# EAGLE schematic EEG (EAGLE 9.6.2)
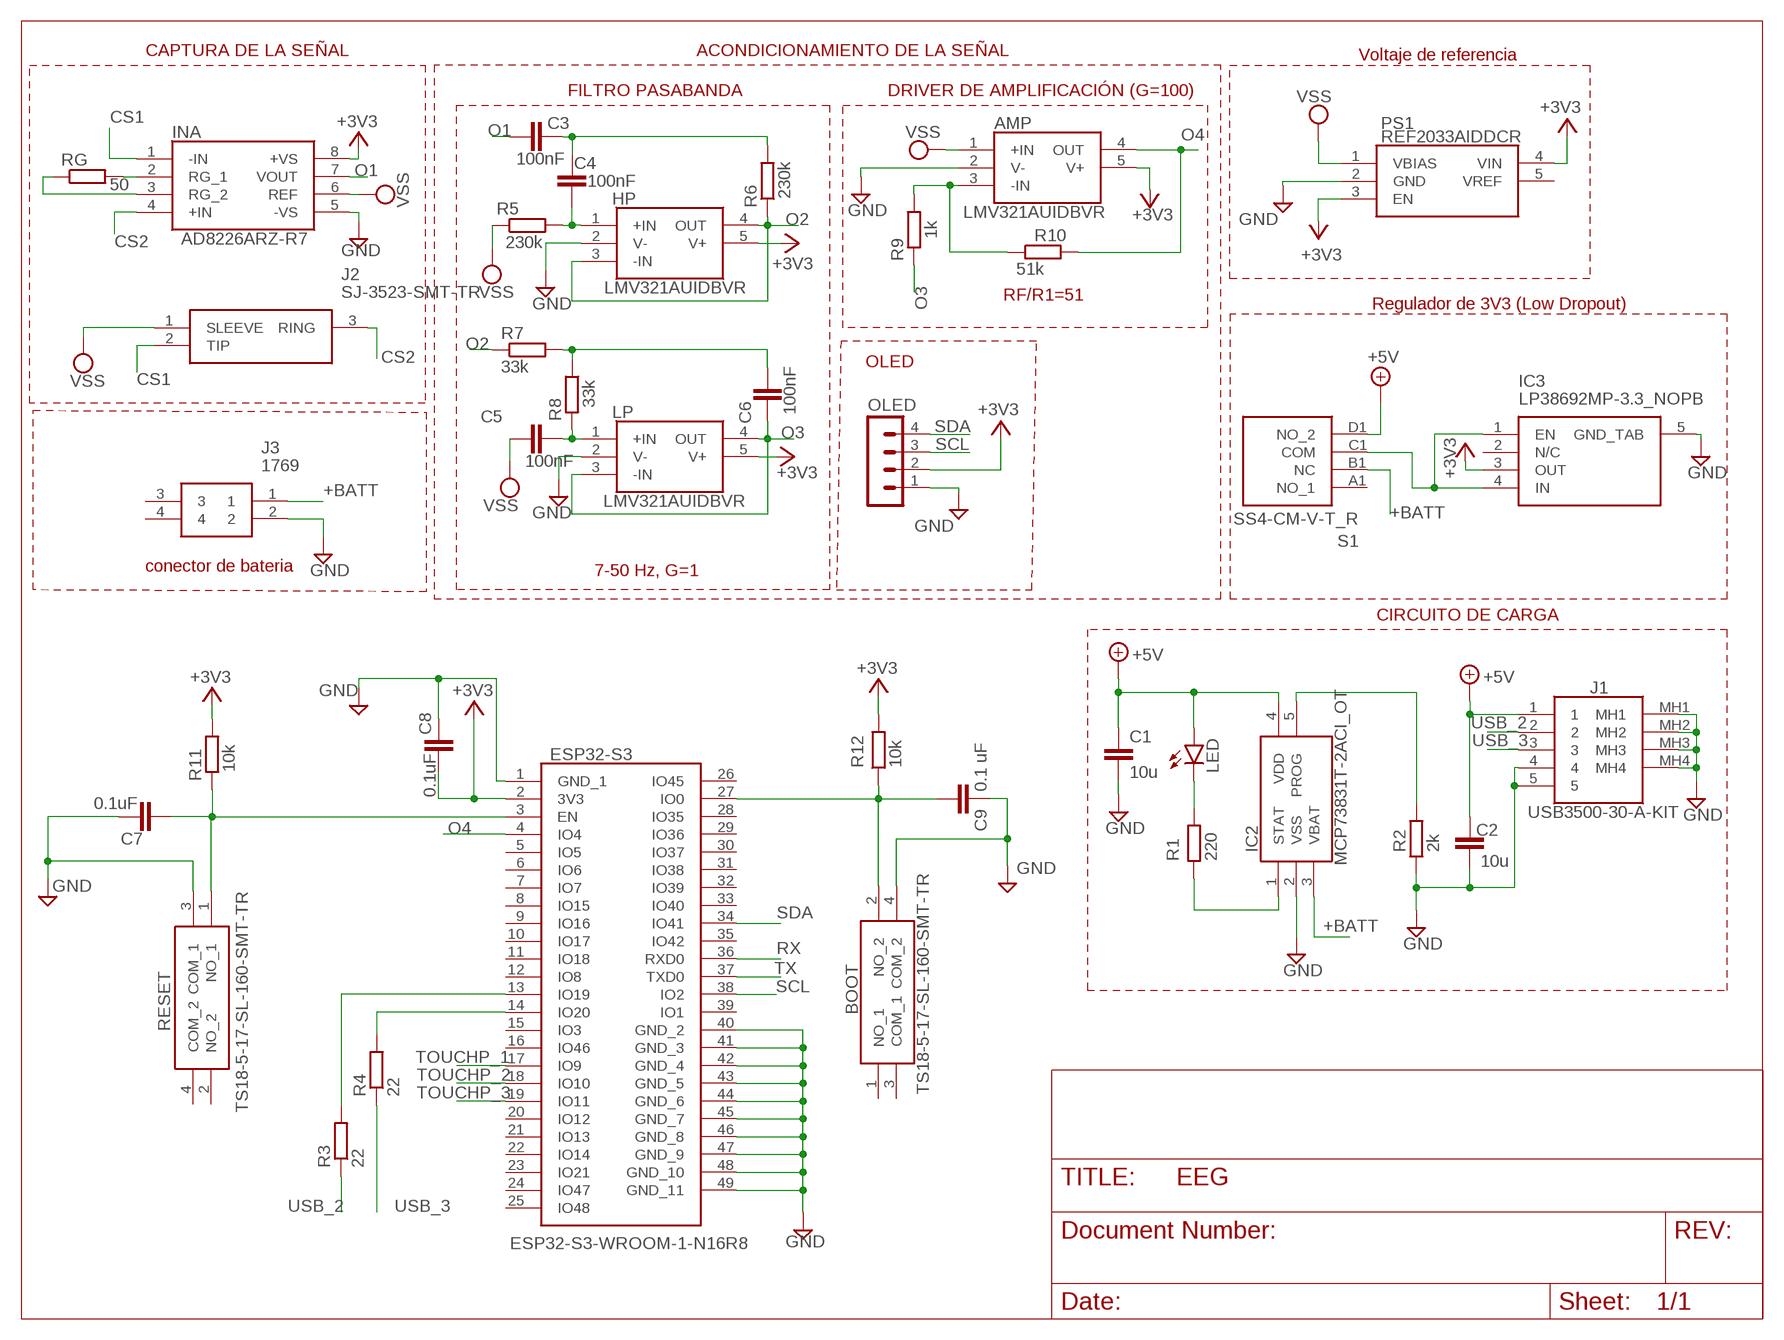
[diagram p0: schematic, sheet 1]

## Parts
AMP  LMV321AUIDBVR  [SOT95P280X145-5N]
BOOT  TS18-5-17-SL-160-SMT-TR  [TS18517SL160SMTTR]
C1  10u  C-EUC0805K  [C0805K]
C2  10u  C-EUC0805K  [C0805K]
C3  100nF  C-EUC0805  [C0805]
C4  100nF  C-EUC0805  [C0805]
C5  100nF  C-EUC0805  [C0805]
C6  100nF  C-EUC0805  [C0805]
C7  0.1uF  C-EUC0805  [C0805]
C8  0.1uF  C-EUC0805  [C0805]
C9  0.1 uF  C-EUC0805  [C0805]
ESP32-S3  ESP32-S3-WROOM-1-N16R8  [ESP32S3WROOM1N16R8]
HP  LMV321AUIDBVR  [SOT95P280X145-5N]
IC2  MCP73831T-2ACI_OT  [SOT95P270X145-5N]
IC3  LP38692MP-3.3_NOPB  [SOT150P700X180-5N]
INA  AD8226ARZ-R7  [SOIC127P600X175-8N]
J1  USB3500-30-A-KIT  [USB350030AKIT]
J2  SJ-3523-SMT-TR  [SJ3523SMTTR]
J3  1769  [1769]
LED  LEDCHIPLED_0805  [CHIPLED_0805]
LP  LMV321AUIDBVR  [SOT95P280X145-5N]
OLED  MA04-1  [MA04-1]
PS1  REF2033AIDDCR  [SOT95P280X110-5N]
R1  220  R-EU_R0805  [R0805]
R2  2k  R-EU_R0805  [R0805]
R3  22  R-EU_R0805  [R0805]
R4  22  R-EU_R0805  [R0805]
R5  230k  R-EU_R0805  [R0805]
R6  230k  R-EU_R0805  [R0805]
R7  33k  R-EU_R0805  [R0805]
R8  33k  R-EU_R0805  [R0805]
R9  1k  R-EU_R0805  [R0805]
R10  51k  R-EU_R0805  [R0805]
R11  10k  R-EU_R0805  [R0805]
R12  10k  R-EU_R0805  [R0805]
RESET  TS18-5-17-SL-160-SMT-TR  [TS18517SL160SMTTR]
RG  50  R-EU_M0805  [M0805]
S1  SS4-CM-V-T_R  [SS4CMVTR]

## Nets
+3V3: AMP.5(V+) C8.1 ESP32-S3.2(3V3) HP.5(V+) IC3.3(OUT) INA.8(+VS) LP.5(V+) OLED.2 PS1.3(EN) PS1.4(VIN) R11.2 R12.2
+5V: C1.1 C2.1 IC2.4(VDD) J1.1 LED.A S1.D1(NO_2)
+BATT: IC2.3(VBAT) J3.1 S1.B1(NC)
CS1: INA.1(-IN) J2.2(TIP)
CS2: INA.4(+IN) J2.3(RING)
GND: AMP.2(V-) BOOT.4(COM_2) C1.2 C2.2 C7.1 C8.2 C9.1 ESP32-S3.1(GND_1) ESP32-S3.40(GND_2) ESP32-S3.41(GND_3) ESP32-S3.42(GND_4) ESP32-S3.43(GND_5) ESP32-S3.44(GND_6) ESP32-S3.45(GND_7) ESP32-S3.46(GND_8) ESP32-S3.47(GND_9) ESP32-S3.48(GND_10) ESP32-S3.49(GND_11) HP.2(V-) IC2.2(VSS) IC3.5(GND_TAB) INA.5(-VS) J1.4 J1.5 J1.MH1 J1.MH2 J1.MH3 J1.MH4 J3.2 LP.2(V-) OLED.1 PS1.2(GND) R2.1 RESET.3(COM_1)
N$2: IC2.5(PROG) R2.2
N$3: LED.C R1.2
N$4: C6.1 R7.2 R8.1
N$5: C4.2 HP.1(+IN) R5.2
N$6: C3.2 C4.1 R6.2
N$7: C5.1 LP.1(+IN) R8.2
N$8: AMP.3(-IN) R9.2 R10.1
N$9: INA.2(RG_1) RG.2
N$10: IC2.1(STAT) R1.1
N$11: IC3.1(EN) IC3.4(IN) S1.C1(COM)
N$12: INA.3(RG_2) RG.1
N$13: BOOT.2(NO_2) C9.2 ESP32-S3.27(IO0) R12.1
N$14: ESP32-S3.14(IO20) R4.2
N$18: ESP32-S3.13(IO19) R3.2
N$19: C7.2 ESP32-S3.3(EN) R11.1 RESET.1(NO_1)
O1: C3.1 INA.7(VOUT)
O2: HP.3(-IN) HP.4(OUT) R6.1 R7.1
O3: C6.2 LP.3(-IN) LP.4(OUT) R9.1
O4: AMP.4(OUT) ESP32-S3.4(IO4) R10.2
RX: ESP32-S3.36(RXD0)
SCL: ESP32-S3.38(IO2) OLED.3
SDA: ESP32-S3.34(IO41) OLED.4
TOUCHP_1: ESP32-S3.17(IO9)
TOUCHP_2: ESP32-S3.18(IO10)
TOUCHP_3: ESP32-S3.19(IO11)
TX: ESP32-S3.37(TXD0)
USB_2: J1.2 R3.1
USB_3: J1.3 R4.1
VSS: AMP.1(+IN) C5.2 INA.6(REF) J2.1(SLEEVE) PS1.1(VBIAS) R5.1
Unconnected: BOOT.1(NO_1) BOOT.3(COM_1) ESP32-S3.5(IO5) ESP32-S3.6(IO6) ESP32-S3.7(IO7) ESP32-S3.8(IO15) ESP32-S3.9(IO16) ESP32-S3.10(IO17) ESP32-S3.11(IO18) ESP32-S3.12(IO8) ESP32-S3.15(IO3) ESP32-S3.16(IO46) ESP32-S3.20(IO12) ESP32-S3.21(IO13) ESP32-S3.22(IO14) ESP32-S3.23(IO21) ESP32-S3.24(IO47) ESP32-S3.25(IO48) ESP32-S3.26(IO45) ESP32-S3.28(IO35) ESP32-S3.29(IO36) ESP32-S3.30(IO37) ESP32-S3.31(IO38) ESP32-S3.32(IO39) ESP32-S3.33(IO40) ESP32-S3.35(IO42) ESP32-S3.39(IO1) IC3.2(N/C) J3.3 J3.4 PS1.5(VREF) RESET.2(NO_2) RESET.4(COM_2) S1.A1(NO_1)

## Notes on the sheet
- CAPTURA DE LA SEÑAL | ACONDICIONAMIENTO DE LA SEÑAL | Voltaje de referencia
- FILTRO PASABANDA | DRIVER DE AMPLIFICACIÓN (G=100)
- RF/R1=51
- Regulador de 3V3 (Low Dropout)
- OLED
- conector de bateria | 7-50 Hz, G=1
- CIRCUITO DE CARGA

## Library data of the parts
AMP HP LP = LMV321AUIDBVR:LMV321AUIDBVR: Operational Amplifiers - Op Amps Single Low-Voltage, Cost-Optimized Rail-to-Rail Output Operational Amplifier 5-SOT-23 -40 to 125 Source: Datasheet <https://www.ti.com/lit/gpn/LMV321A>; DESCRIPTION: Operational Amplifiers - Op Amps Single Low-Voltage, Cost-Optimized Rail-to-Rail Output Operational Amplifier 5-SOT-23 -40 to 125; HEIGHT: 1.45mm; MANUFACTURER_NAME: Texas Instruments; MANUFACTURER_PART_NUMBER: LMV321AUIDBVR; MOUSER_PART_NUMBER: 595-LMV321AUIDBVR; MOUSER_PRICE-STOCK: https://www.mouser.co.uk/ProductDetail/Texas-Instruments/LMV321AUIDBVR?qs=GBLSl2AkirulEcoP6K7rtg%3D%3D
BOOT RESET = TS18-5-17-SL-160-SMT-TR:TS18-5-17-SL-160-SMT-TR: 5 x 5 mm, 1.7 mm Actuator Height, 160 gf, Silver, Surface Mount, TR, SPST, Tactile Switch Source: Datasheet <https://www.sameskydevices.com/product/resource/supplyframepdf/ts18.pdf>; DESCRIPTION: 5 x 5 mm, 1.7 mm Actuator Height, 160 gf, Silver, Surface Mount, TR, SPST, Tactile Switch; HEIGHT: 1.8mm; MANUFACTURER_NAME: Same Sky; MANUFACTURER_PART_NUMBER: TS18-5-17-SL-160-SMT-TR; MOUSER_PART_NUMBER: 179-TS18517SL160SMTT; MOUSER_PRICE-STOCK: https://www.mouser.co.uk/ProductDetail/CUI-Devices/TS18-5-17-SL-160-SMT-TR?qs=tlsG%2FOw5FFhWy38y3t272A%3D%3D
C1-C9 = rcl:C-EU: CAPACITOR, European symbol; SPICEPREFIX: C
ESP32-S3 = ESP32-S3-WROOM-1-N16R8:ESP32-S3-WROOM-1-N16R8: Multiprotocol Modules SMD Module, ESP32-S3R8, 3.3V, 8 MB Octal PSRAM Die, 16 MB Quad SPI Flash, PCB Antenna Source: Datasheet <https://www.espressif.com/sites/default/files/documentation/esp32-s3-wroom-1_wroom-1u_datasheet_en.pdf>; DESCRIPTION: Multiprotocol Modules SMD Module, ESP32-S3R8, 3.3V, 8 MB Octal PSRAM Die, 16 MB Quad SPI Flash, PCB Antenna; HEIGHT: 3.25mm; MANUFACTURER_NAME: Espressif Systems; MANUFACTURER_PART_NUMBER: ESP32-S3-WROOM-1-N16R8; MOUSER_PART_NUMBER: 356-ESP32S3WRM1N16R8; MOUSER_PRICE-STOCK: https://www.mouser.co.uk/ProductDetail/Espressif-Systems/ESP32-S3-WROOM-1-N16R8?qs=Li%252BoUPsLEnvQc9gW6AMhZg%3D%3D
IC2 = MCP73831T-2ACI_OT:MCP73831T-2ACI_OT: Li-Ion Charge Controller 4.2V SOT23-5 Source: Datasheet <http://ww1.microchip.com/downloads/en/DeviceDoc/20001984g.pdf>; DESCRIPTION: Li-Ion Charge Controller 4.2V SOT23-5; HEIGHT: 1.45mm; MANUFACTURER_NAME: Microchip; MANUFACTURER_PART_NUMBER: MCP73831T-2ACI/OT; MOUSER_PART_NUMBER: 579-MCP73831T-2ACIOT; MOUSER_PRICE-STOCK: https://www.mouser.co.uk/ProductDetail/Microchip-Technology/MCP73831T-2ACI-OT?qs=yUQqVecv4qvbBQBGbHx0Mw%3D%3D
IC3 = LP38692MP-3.3_NOPB:LP38692MP-3.3_NOPB: LP38692MP-3.3/NOPB, Low Dropout Voltage Regulator, 1A, 3.3 V +/-2.5%, 2.7 10 Vin, 5-Pin SOT-223 Source: Datasheet <http://www.ti.com/lit/ds/symlink/lp38692.pdf>; DESCRIPTION: LP38692MP-3.3/NOPB, Low Dropout Voltage Regulator, 1A, 3.3 V +/-2.5%, 2.7 10 Vin, 5-Pin SOT-223; HEIGHT: 1.8mm; MANUFACTURER_NAME: Texas Instruments; MANUFACTURER_PART_NUMBER: LP38692MP-3.3/NOPB; MOUSER_PART_NUMBER: 926-LP38692MP3.3NOPB; MOUSER_PRICE-STOCK: https://www.mouser.co.uk/ProductDetail/Texas-Instruments/LP38692MP-3.3-NOPB?qs=1FNqv8aZn1TpKuOP2NKBdg%3D%3D
INA = AD8226ARZ-R7:AD8226ARZ-R7: Wide Supply Range, Rail-to-Rail Output Instrumentation Amplifier Source: Datasheet <http://componentsearchengine.com/Datasheets/3/AD8226ARZ-R7.pdf>; DESCRIPTION: Wide Supply Range, Rail-to-Rail Output Instrumentation Amplifier; HEIGHT: 1.75mm; MANUFACTURER_NAME: Analog Devices; MANUFACTURER_PART_NUMBER: AD8226ARZ-R7; MOUSER_PART_NUMBER: 584-AD8226ARZ-R7; MOUSER_PRICE-STOCK: https://www.mouser.co.uk/ProductDetail/Analog-Devices/AD8226ARZ-R7?qs=%2FtpEQrCGXCxwcvDsZqDBEQ%3D%3D
J1 = USB3500-30-A-KIT:USB3500-30-A-KIT: USB Connectors Micro B Skt, Mid Mount-SMT, R/A, 30u", With Peg, T&R, IP67 + USBTJ-02 Gasket Source: Datasheet <https://gct.co/files/drawings/usb3500.pdf>; DESCRIPTION: USB Connectors Micro B Skt, Mid Mount-SMT, R/A, 30u", With Peg, T&R, IP67 + USBTJ-02 Gasket; HEIGHT: 2.8mm; MANUFACTURER_NAME: GCT (GLOBAL CONNECTOR TECHNOLOGY); MANUFACTURER_PART_NUMBER: USB3500-30-A-KIT; MOUSER_PART_NUMBER: 640-USB3500-30-A-KIT; MOUSER_PRICE-STOCK: https://www.mouser.co.uk/ProductDetail/GCT/USB3500-30-A-KIT?qs=KUoIvG%2F9IlZmD2kH2DfgYg%3D%3D
J2 = SJ-3523-SMT-TR:SJ-3523-SMT-TR: 3.5 mm, Stereo, Right Angle, Surface Mount (SMT), 3 Conductors, 0 Internal Switches, Audio Jack Connector Source: Datasheet <https://www.sameskydevices.com/product/resource/supplyframepdf/sj-352x-smt.pdf>; DESCRIPTION: 3.5 mm, Stereo, Right Angle, Surface Mount (SMT), 3 Conductors, 0 Internal Switches, Audio Jack Connector; HEIGHT: 5.2mm; MANUFACTURER_NAME: Same Sky; MANUFACTURER_PART_NUMBER: SJ-3523-SMT-TR; MOUSER_PART_NUMBER: 490-SJ-3523-SMT-TR; MOUSER_PRICE-STOCK: https://www.mouser.co.uk/ProductDetail/CUI-Devices/SJ-3523-SMT-TR?qs=WyjlAZoYn51zOHzJ3r4ZRA%3D%3D
J3 = 1769 (1):1769: Adafruit Accessories JST-PH 2-pin SMT Right Angle Connect Source: Datasheet <https://cdn-shop.adafruit.com/datasheets/17311.pdf>; ARROW_PART_NUMBER: 1769; ARROW_PRICE-STOCK: https://www.arrow.com/en/products/1769/adafruit-industries?utm_currency=USD&region=nac; DESCRIPTION: Adafruit Accessories JST-PH 2-pin SMT Right Angle Connect; HEIGHT: 5.5mm; MANUFACTURER_NAME: Adafruit; MANUFACTURER_PART_NUMBER: 1769; MOUSER_PART_NUMBER: 485-1769; MOUSER_PRICE-STOCK: https://www.mouser.co.uk/ProductDetail/Adafruit/1769?qs=GURawfaeGuBbgoGtf2XstA%3D%3D
LED = led:LED: LED OSRAM: - CHIPLED LG R971, LG N971, LY N971, LG Q971, LY Q971, LO R971, LY R971 LH N974, LH R974 LS Q976, LO Q976, LY Q976 LO Q996 - Hyper CHIPLED LW Q18S LB Q993, LB Q99A, LB R99A - SideLED LS A670, LO A670, LY A670, LG A670, LP A670 LB A673, LV A673, LT A673, LW A673 LH A674 LY A675 LS A676, LA A676, LO A676, LY A676, LW A676 LS A679, LY A679, LG A679 - Hyper Micro SIDELED® LS Y876, LA Y876, LO Y876, LY Y876 LT Y87S - SmartLED LW L88C, LW L88S LB L89C, LB L89S, LG L890 LS L89K, LO L89K, LY L89K LS L896, LA L896, LO L896, LY L896 - TOPLED LS T670, LO T670, LY T670, LG T670, LP T670 LSG T670, LSP T670, LSY T670, LOP T670, LYG T670 LG T671, LOG T671, LSG T671 LB T673, LV T673, LT T673, LW T673 LH T674 LS T676, LA T676, LO T676, LY T676, LB T676, LH T676, LSB T676, LW T676 LB T67C, LV T67C, LT T67C, LS T67K, LO T67K, LY T67K, LW E67C LS E67B, LA E67B, LO E67B, LY E67B, LB E67C, LV E67C, LT E67C LW T67C LS T679, LY T679, LG T679 LS T770, LO T770, LY T770, LG T770, LP T770 LB T773, LV T773, LT T773, LW T773 LH T774 LS E675, LA E675, LY E675, LS T675 LS T776, LA T776, LO T776, LY T776, LB T776 LHGB T686 LT T68C, LB T68C - Hyper Mini TOPLED® LB M676 - Mini TOPLED Santana® LG M470 LS M47K, LO M47K, LY M47K Source: http://www.osram.convergy.de LUXEON: - LUMILED® LXK2-PW12-R00, LXK2-PW12-S00, LXK2-PW14-U00, LXK2-PW14-V00 LXK2-PM12-R00, LXK2-PM12-S00, LXK2-PM14-U00 LXK2-PE12-Q00, LXK2-PE12-R00, LXK2-PE12-S00, LXK2-PE14-T00, LXK2-PE14-U00 LXK2-PB12-K00, LXK2-PB12-L00, LXK2-PB12-M00, LXK2-PB14-N00, LXK2-PB14-P00, LXK2-PB14-Q00 LXK2-PR12-L00, LXK2-PR12-M00, LXK2-PR14-Q00, LXK2-PR14-R00 LXK2-PD12-Q00, LXK2-PD12-R00, LXK2-PD12-S00 LXK2-PH12-R00, LXK2-PH12-S00 LXK2-PL12-P00, LXK2-PL12-Q00, LXK2-PL12-R00 Source: www.luxeon.com KINGBRIGHT: KA-3528ASYC Source: www.kingbright.com
OLED = con-lstb:MA04-1: PIN HEADER; OC_FARNELL: unknown; OC_NEWARK: unknown
PS1 = REF2033AIDDCR:REF2033AIDDCR: Low-Drift, Low-Power, Dual-Output Vref and Vref/2 Voltage Reference Source: Datasheet <http://www.ti.com/lit/ds/symlink/ref2033.pdf>; DESCRIPTION: Low-Drift, Low-Power, Dual-Output Vref and Vref/2 Voltage Reference; HEIGHT: 1.1mm; MANUFACTURER_NAME: Texas Instruments; MANUFACTURER_PART_NUMBER: REF2033AIDDCR; MOUSER_PART_NUMBER: 595-REF2033AIDDCR; MOUSER_PRICE-STOCK: https://www.mouser.co.uk/ProductDetail/Texas-Instruments/REF2033AIDDCR?qs=7z%252BmIopC6%2FKHHOBVNaL7UQ%3D%3D
R1-R12 RG = rcl:R-EU_: RESISTOR, European symbol; SPICEPREFIX: R
S1 = SS4-CM-V-T_R:SS4-CM-V-T_R: Slide Switches Slide Type 1P3T (2.0mm height) Source: Datasheet <https://componentsearchengine.com/Datasheets/1/SS4-CM-V-T_R.pdf>; DESCRIPTION: Slide Switches Slide Type 1P3T (2.0mm height); HEIGHT: 2mm; MANUFACTURER_NAME: Diptronics; MANUFACTURER_PART_NUMBER: SS4-CM-V-T/R; MOUSER_PART_NUMBER: 113-SS4CMVTR; MOUSER_PRICE-STOCK: https://www.mouser.co.uk/ProductDetail/Diptronics/SS4-CM-V-T-R?qs=MLItCLRbWswqNEU%2F6grMKg%3D%3D